# EAGLE design mcu_rev2 (EAGLE 9.5.0)

## Sheet 1 of 2
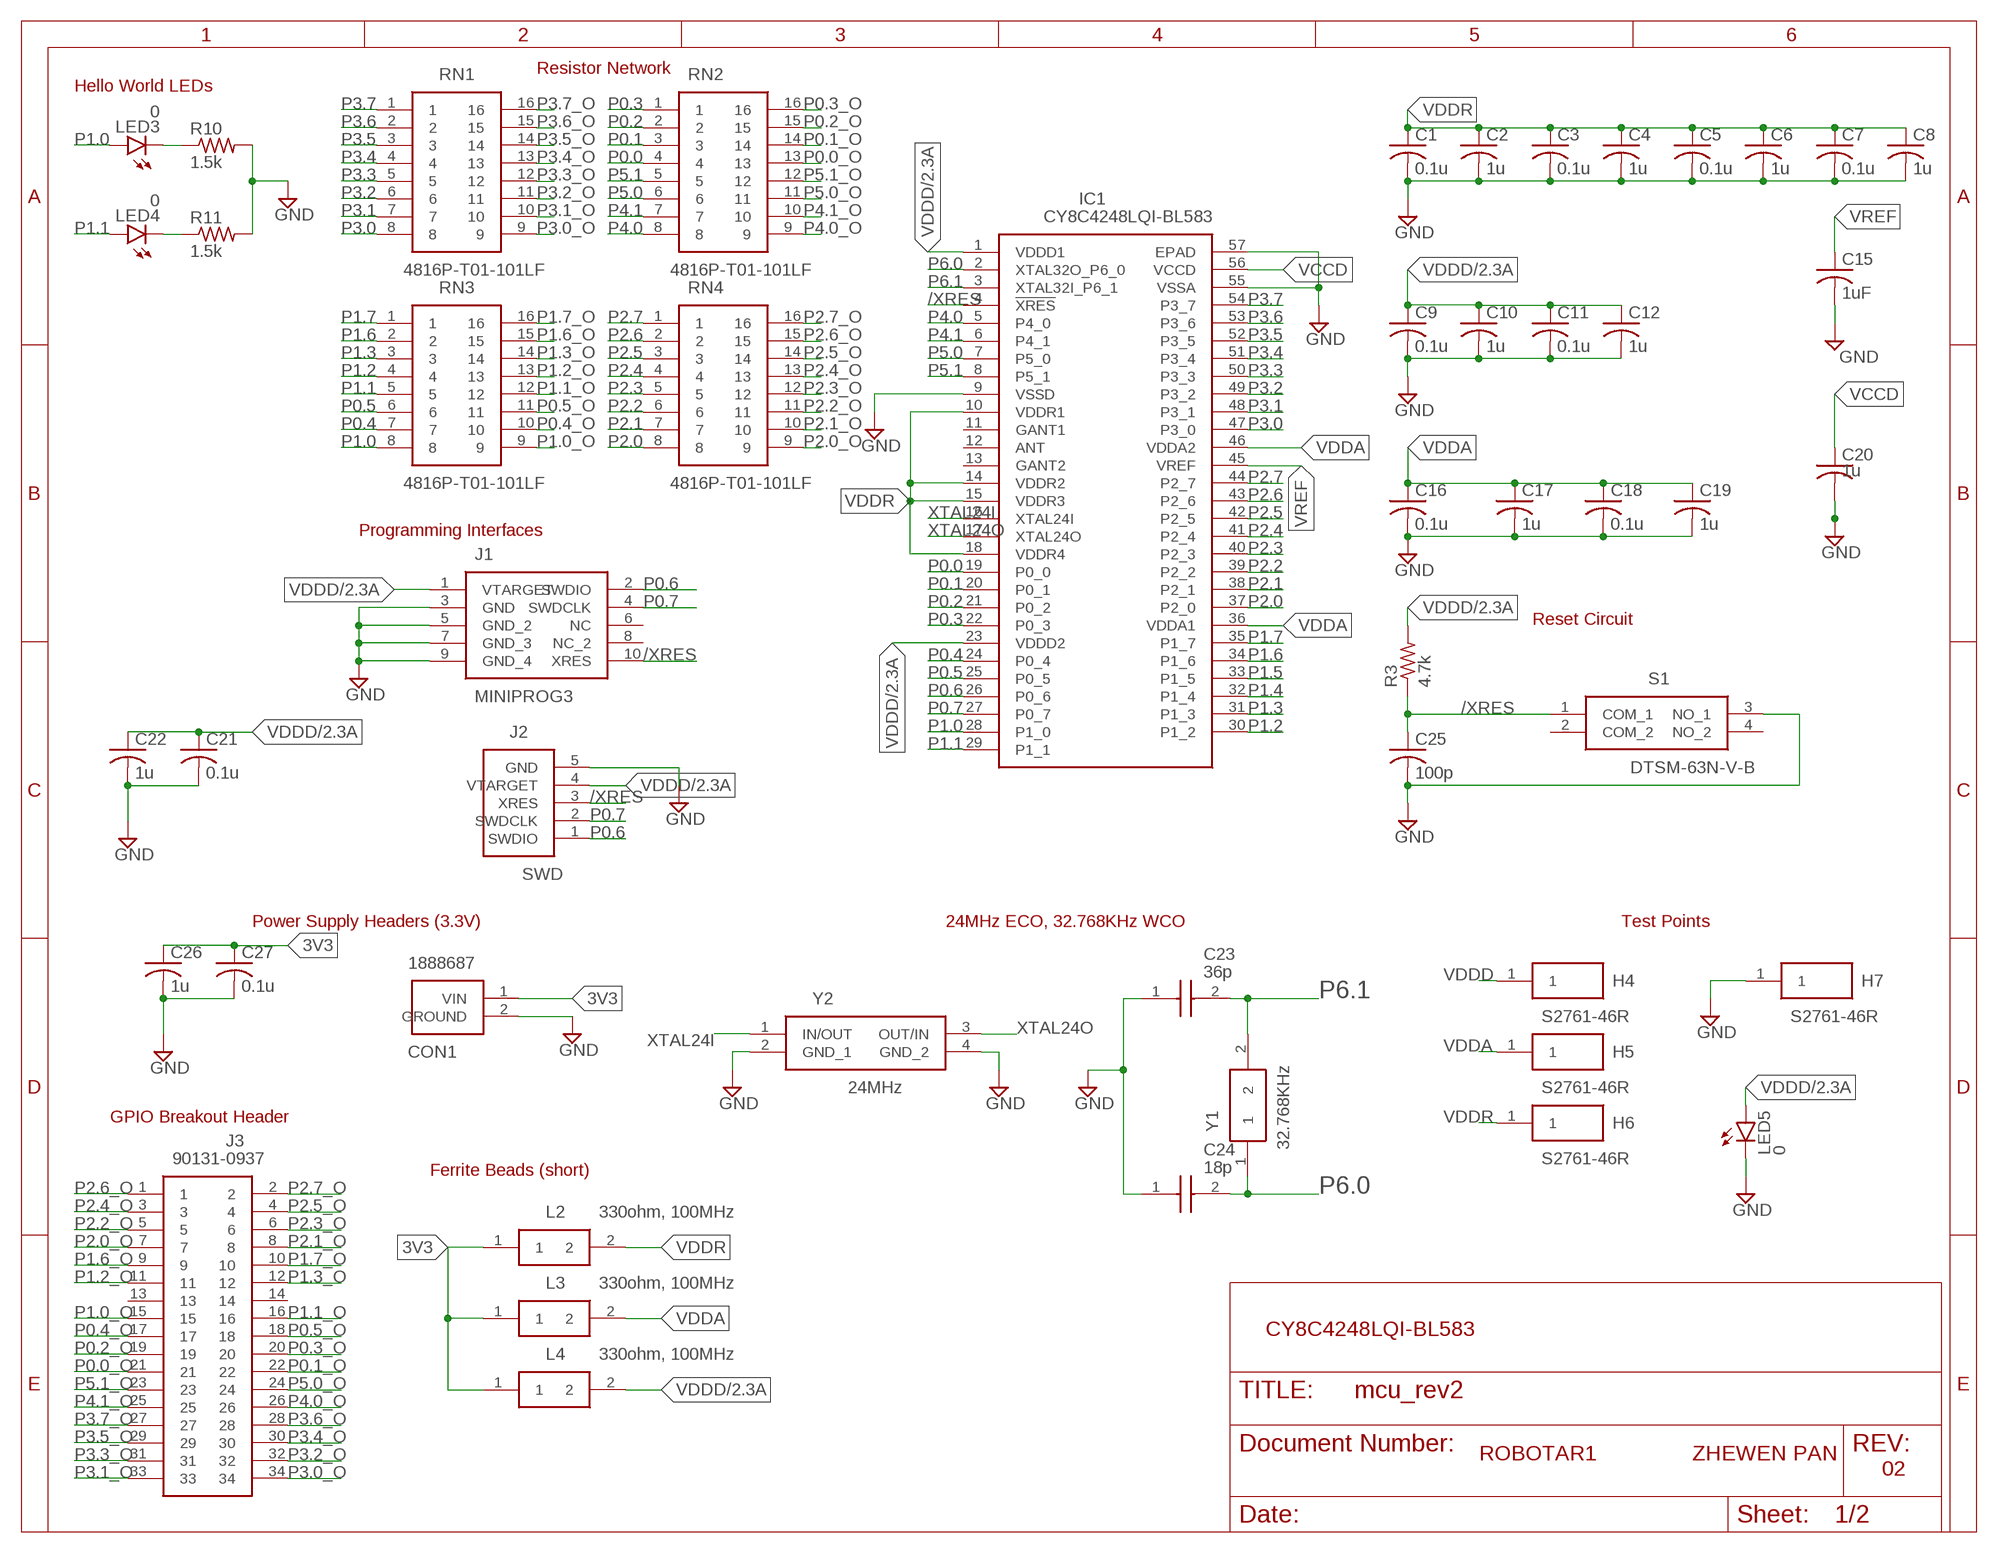
[diagram p0: schematic, sheet 1]

### Parts
C1  0.1u  C-USC0805  [C0805]
C2  1u  C-USC0805  [C0805]
C3  0.1u  C-USC0805  [C0805]
C4  1u  C-USC0805  [C0805]
C5  0.1u  C-USC0805  [C0805]
C6  1u  C-USC0805  [C0805]
C7  0.1u  C-USC0805  [C0805]
C8  1u  C-USC0805  [C0805]
C9  0.1u  C-USC0805  [C0805]
C10  1u  C-USC0805  [C0805]
C11  0.1u  C-USC0805  [C0805]
C12  1u  C-USC0805  [C0805]
C15  1uF  C-USC0805  [C0805]
C16  0.1u  C-USC0805  [C0805]
C17  1u  C-USC0805  [C0805]
C18  0.1u  C-USC0805  [C0805]
C19  1u  C-USC0805  [C0805]
C20  1u  C-USC0805  [C0805]
C21  0.1u  C-USC0805  [C0805]
C22  1u  C-USC0805  [C0805]
C23  36p  GRM1555C1H360JA01D  [CAPC1005X55N]
C24  18p  GRM1555C1H180FA01D  [CAPC1005X55N]
C25  100p  C-USC0805  [C0805]
C26  1u  C-USC0805  [C0805]
C27  0.1u  C-USC0805  [C0805]
CON1  1888687  [SHDR2W90P0X508_1X2_1016X950X15]
H4  S2761-46R  [S276146R]
H5  S2761-46R  [S276146R]
H6  S2761-46R  [S276146R]
H7  S2761-46R  [S276146R]
IC1  CY8C4248LQI-BL583  [QFN40P700X700X60-57N]
J1  MINIPROG3  FTSH-105-01-L-DV-K  [FTSH-105-01-L-DV-K]
J2  SWD  22-23-2051  [HDRV5W64P0X254_1X5_1255X635X81]
J3  90131-0937  [HDRV34W90P254_2X17_4308X500X56]
L2  330ohm, 100MHz  BLM21PG331SN1D  [BEADC2012X105N]
L3  330ohm, 100MHz  BLM21PG331SN1D  [BEADC2012X105N]
L4  330ohm, 100MHz  BLM21PG331SN1D  [BEADC2012X105N]
LED3  0  LEDSML0805  [SML0805]
LED4  0  LEDSML0805  [SML0805]
LED5  0  LEDCHIP-LED0805  [CHIP-LED0805]
R3  4.7k  R-US_R0805  [R0805]
R10  1.5k  R-US_R0805  [R0805]
R11  1.5k  R-US_R0805  [R0805]
RN1  4816P-T01-101LF  [SOIC127P762X215-16N]
RN2  4816P-T01-101LF  [SOIC127P762X215-16N]
RN3  4816P-T01-101LF  [SOIC127P762X215-16N]
RN4  4816P-T01-101LF  [SOIC127P762X215-16N]
S1  DTSM-63N-V-B  [DTSM63NVB]
Y1  32.768KHz  ECS-.327-12.5-34B-TR  [ECX-31B]
Y2  24MHz  ECS-240-8-36CKM-TR  [ECS240836QAESTR]

### Nets
3V3: C26.1 C27.1 CON1.1(VIN) L2.1 L3.1 L4.1
/XRES: C25.1 IC1.4(!XRES) J1.10(XRES) J2.3(XRES) R3.1 S1.1(COM_1)
GND: C1.2 C2.2 C3.2 C4.2 C5.2 C6.2 C7.2 C8.2 C9.2 C10.2 C11.2 C12.2 C15.2 C16.2 C17.2 C18.2 C19.2 C20.2 C21.2 C22.2 C23.1 C24.1 C25.2 C26.2 C27.2 CON1.2(GROUND) H7.1 IC1.9(VSSD) IC1.55(VSSA) IC1.57(EPAD) J1.3(GND) J1.5(GND_2) J1.7(GND_3) J1.9(GND_4) J2.5(GND) LED5.C R10.2 R11.2 S1.3(NO_1) Y2.2(GND_1) Y2.4(GND_2) ; also sheet 2
N$1: LED3.C R10.1
N$2: LED4.C R11.1
P0.0: IC1.19(P0_0) RN2.4
P0.0_O: J3.21 RN2.13
P0.1: IC1.20(P0_1) RN2.3
P0.1_O: J3.22 RN2.14
P0.2: IC1.21(P0_2) RN2.2
P0.2_O: J3.19 RN2.15
P0.3: IC1.22(P0_3) RN2.1
P0.3_O: J3.20 RN2.16
P0.4: IC1.24(P0_4) RN3.7
P0.4_O: J3.17 RN3.10
P0.5: IC1.25(P0_5) RN3.6
P0.5_O: J3.18 RN3.11
P0.6: IC1.26(P0_6) J1.2(SWDIO) J2.1(SWDIO)
P0.7: IC1.27(P0_7) J1.4(SWDCLK) J2.2(SWDCLK)
P1.0: IC1.28(P1_0) LED3.A RN3.8
P1.0_O: J3.15 RN3.9
P1.1: IC1.29(P1_1) LED4.A RN3.5
P1.1_O: J3.16 RN3.12
P1.2: IC1.30(P1_2) RN3.4
P1.2_O: J3.11 RN3.13
P1.3: IC1.31(P1_3) RN3.3
P1.3_O: J3.12 RN3.14
P1.4: IC1.32(P1_4) ; also sheet 2
P1.5: IC1.33(P1_5) ; also sheet 2
P1.6: IC1.34(P1_6) RN3.2 ; also sheet 2
P1.6_O: J3.9 RN3.15
P1.7: IC1.35(P1_7) RN3.1
P1.7_O: J3.10 RN3.16
P2.0: IC1.37(P2_0) RN4.8
P2.0_O: J3.7 RN4.9
P2.1: IC1.38(P2_1) RN4.7
P2.1_O: J3.8 RN4.10
P2.2: IC1.39(P2_2) RN4.6
P2.2_O: J3.5 RN4.11
P2.3: IC1.40(P2_3) RN4.5
P2.3_O: J3.6 RN4.12
P2.4: IC1.41(P2_4) RN4.4
P2.4_O: J3.3 RN4.13
P2.5: IC1.42(P2_5) RN4.3
P2.5_O: J3.4 RN4.14
P2.6: IC1.43(P2_6) RN4.2
P2.6_O: J3.1 RN4.15
P2.7: IC1.44(P2_7) RN4.1
P2.7_O: J3.2 RN4.16
P3.0: IC1.47(P3_0) RN1.8
P3.0_O: J3.34 RN1.9
P3.1: IC1.48(P3_1) RN1.7
P3.1_O: J3.33 RN1.10
P3.2: IC1.49(P3_2) RN1.6
P3.2_O: J3.32 RN1.11
P3.3: IC1.50(P3_3) RN1.5
P3.3_O: J3.31 RN1.12
P3.4: IC1.51(P3_4) RN1.4
P3.4_O: J3.30 RN1.13
P3.5: IC1.52(P3_5) RN1.3
P3.5_O: J3.29 RN1.14
P3.6: IC1.53(P3_6) RN1.2
P3.6_O: J3.28 RN1.15
P3.7: IC1.54(P3_7) RN1.1
P3.7_O: J3.27 RN1.16
P4.0: IC1.5(P4_0) RN2.8
P4.0_O: J3.26 RN2.9
P4.1: IC1.6(P4_1) RN2.7
P4.1_O: J3.25 RN2.10
P5.0: IC1.7(P5_0) RN2.6
P5.0_O: J3.24 RN2.11
P5.1: IC1.8(P5_1) RN2.5
P5.1_O: J3.23 RN2.12
P6.0: C24.2 IC1.2(XTAL32O_P6_0) Y1.1
P6.1: C23.2 IC1.3(XTAL32I_P6_1) Y1.2
VCCD: C20.1 IC1.56(VCCD)
VDDA: C16.1 C17.1 C18.1 C19.1 H5.1 IC1.36(VDDA1) IC1.46(VDDA2) L3.2
VDDD: C9.1 C10.1 C11.1 C12.1 C21.1 C22.1 H4.1 IC1.1(VDDD1) IC1.23(VDDD2) J1.1(VTARGET) J2.4(VTARGET) L4.2 LED5.A R3.2 ; also sheet 2
VDDR: C1.1 C2.1 C3.1 C4.1 C5.1 C6.1 C7.1 C8.1 H6.1 IC1.10(VDDR1) IC1.14(VDDR2) IC1.15(VDDR3) IC1.18(VDDR4) L2.2
VREF: C15.1 IC1.45(VREF)
XTAL24I: IC1.16(XTAL24I) Y2.1(IN/OUT)
XTAL24O: IC1.17(XTAL24O) Y2.3(OUT/IN)
Unconnected: IC1.11(GANT1) IC1.12(ANT) IC1.13(GANT2) J1.6(NC) J1.8(NC_2) J3.13 J3.14 S1.2(COM_2) S1.4(NO_2)

### Notes on the sheet
- Resistor Network
- Hello World LEDs
- Programming Interfaces
- Reset Circuit
- Power Supply Headers (3.3V) | 24MHz ECO, 32.768KHz WCO | Test Points
- GPIO Breakout Header
- Ferrite Beads (short)
- CY8C4248LQI-BL583
- ROBOTAR1 | ZHEWEN PAN | 02

## Sheet 2 of 2
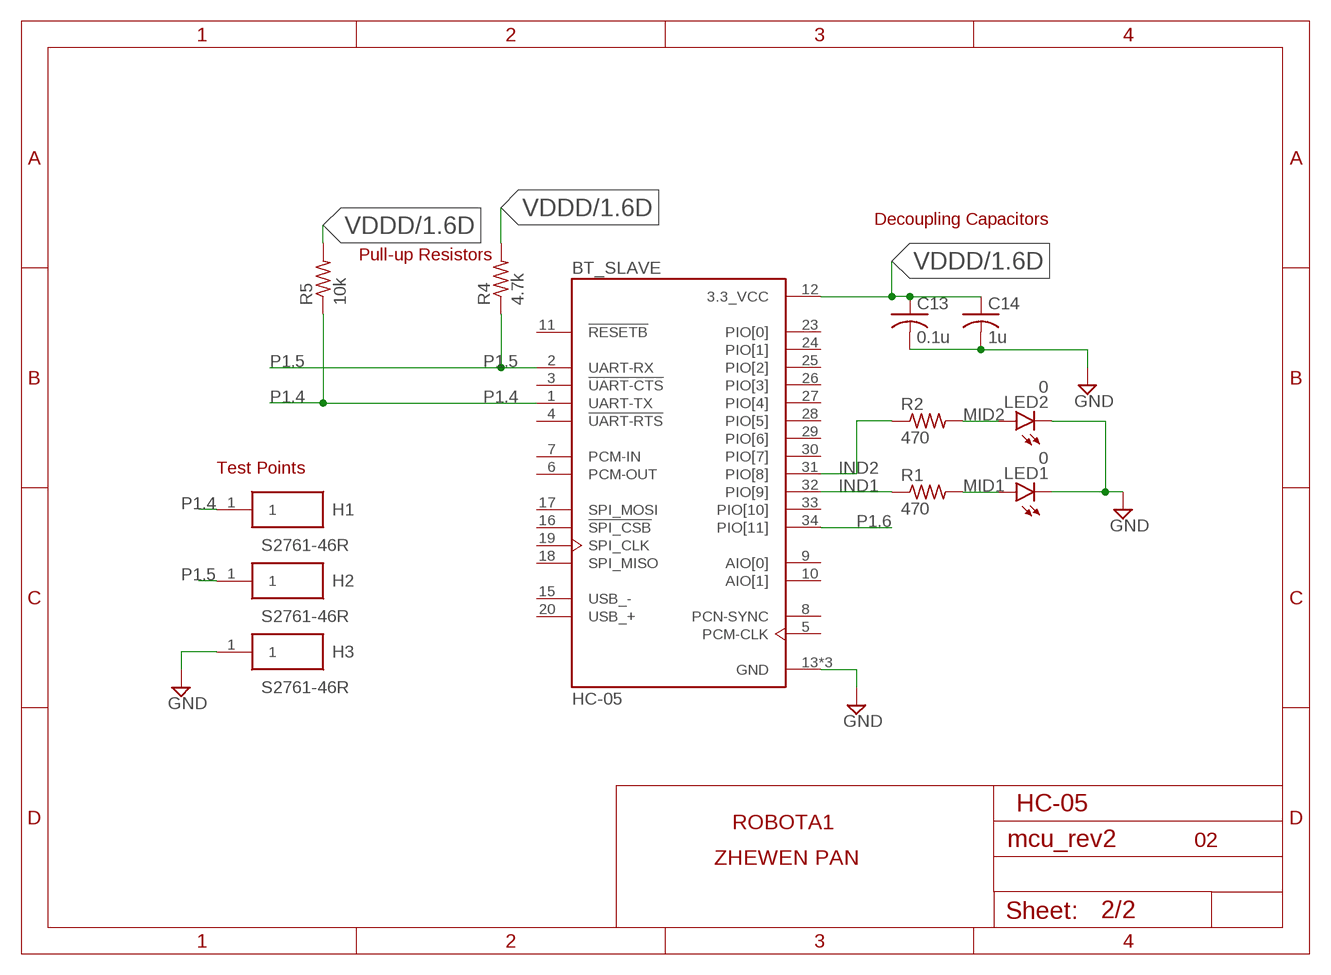
[diagram p1: schematic, sheet 2]

### Parts
BT_SLAVE  HC-05  [XCVR_HC-05]
C13  0.1u  C-USC0805  [C0805]
C14  1u  C-USC0805  [C0805]
H1  S2761-46R  [S276146R]
H2  S2761-46R  [S276146R]
H3  S2761-46R  [S276146R]
LED1  0  LEDSML0805  [SML0805]
LED2  0  LEDSML0805  [SML0805]
R1  470  R-US_R0805  [R0805]
R2  470  R-US_R0805  [R0805]
R4  4.7k  R-US_R0805  [R0805]
R5  10k  R-US_R0805  [R0805]

### Nets
GND: BT_SLAVE.13(GND) BT_SLAVE.21(GND) BT_SLAVE.22(GND) C13.2 C14.2 H3.1 LED1.C LED2.C ; also sheet 1
IND1: BT_SLAVE.32(PIO[9]) R1.1
IND2: BT_SLAVE.31(PIO[8]) R2.1
MID1: LED1.A R1.2
MID2: LED2.A R2.2
P1.4: BT_SLAVE.1(UART-TX) H1.1 R5.1 ; also sheet 1
P1.5: BT_SLAVE.2(UART-RX) H2.1 R4.1 ; also sheet 1
P1.6: BT_SLAVE.34(PIO[11]) ; also sheet 1
VDDD: BT_SLAVE.12(3.3_VCC) C13.1 C14.1 R4.2 R5.2 ; also sheet 1
Unconnected: BT_SLAVE.3(!UART-CTS) BT_SLAVE.4(!UART-RTS) BT_SLAVE.5(PCM-CLK) BT_SLAVE.6(PCM-OUT) BT_SLAVE.7(PCM-IN) BT_SLAVE.8(PCN-SYNC) BT_SLAVE.9(AIO[0]) BT_SLAVE.10(AIO[1]) BT_SLAVE.11(!RESETB) BT_SLAVE.15(USB_-) BT_SLAVE.16(!SPI_CSB) BT_SLAVE.17(SPI_MOSI) BT_SLAVE.18(SPI_MISO) BT_SLAVE.19(SPI_CLK) BT_SLAVE.20(USB_+) BT_SLAVE.23(PIO[0]) BT_SLAVE.24(PIO[1]) BT_SLAVE.25(PIO[2]) BT_SLAVE.26(PIO[3]) BT_SLAVE.27(PIO[4]) BT_SLAVE.28(PIO[5]) BT_SLAVE.29(PIO[6]) BT_SLAVE.30(PIO[7]) BT_SLAVE.33(PIO[10])

### Notes on the sheet
- Decoupling Capacitors
- Pull-up Resistors
- Test Points
- HC-05
- ROBOTA1
- 02
- ZHEWEN PAN

## Library data of the parts
BT_SLAVE = HC-05:HC-05: Bluetooth to Serial Port Module; AVAILABILITY: Unavailable; MF: Texas Instruments; MP: HC-05; PACKAGE: SOIC-14; PRICE: None; SPICEPREFIX: X
C1-C22 C25-C27 = rcl:C-US: CAPACITOR, American symbol; SPICEPREFIX: C
C23 = GRM1555C1H360JA01D:GRM1555C1H360JA01D: Murata 0402 GRM 36pF Ceramic Multilayer Capacitor, 50 V dc, +125C, C0G Dielectric, +/-5% SMD Source: Datasheet <http://uk.rs-online.com/web/p/products/8145643P>; DESCRIPTION: Murata 0402 GRM 36pF Ceramic Multilayer Capacitor, 50 V dc, +125C, C0G Dielectric, +/-5% SMD; HEIGHT: 0.55mm; MANUFACTURER_NAME: Murata Electronics; MANUFACTURER_PART_NUMBER: GRM1555C1H360JA01D; RS_PART_NUMBER: 8145643P; RS_PRICE-STOCK: http://uk.rs-online.com/web/p/products/8145643P
C24 = GRM1555C1H180FA01D:GRM1555C1H180FA01D: Murata 0402 GRM 18pF Ceramic Multilayer Capacitor, 50 V dc, +125C, C0G Dielectric SMD Source: Datasheet <http://uk.rs-online.com/web/p/products/7235373P>; DESCRIPTION: Murata 0402 GRM 18pF Ceramic Multilayer Capacitor, 50 V dc, +125C, C0G Dielectric SMD; HEIGHT: 0.55mm; MANUFACTURER_NAME: Murata Electronics; MANUFACTURER_PART_NUMBER: GRM1555C1H180FA01D; RS_PART_NUMBER: 7235373P; RS_PRICE-STOCK: http://uk.rs-online.com/web/p/products/7235373P
CON1 = SamacSys_Parts:1888687: Phoenix Contact COMBICON MKDSN Series 5.08mm Pitch Straight PCB Terminal Block with Screw Termination, Through Hole Source: Datasheet <http://uk.rs-online.com/web/p/products/8045095>; ALLIED_NUMBER: 70054422; DESCRIPTION: Phoenix Contact COMBICON MKDSN Series 5.08mm Pitch Straight PCB Terminal Block with Screw Termination, Through Hole; HEIGHT: 15mm; MANUFACTURER_NAME: Phoenix Contact; MANUFACTURER_PART_NUMBER: 1888687; RS_PART_NUMBER: 8045095; RS_PRICE-STOCK: http://uk.rs-online.com/web/p/products/8045095
H1-H7 = S2761-46R:S2761-46R: Circuit Board Hardware - PCB SMT Mini Test Terminal, Reel Source: Datasheet <https://cdn.harwin.com/pdfs/S2761R.pdf>; DESCRIPTION: Circuit Board Hardware - PCB SMT Mini Test Terminal, Reel; HEIGHT: 1.15mm; MANUFACTURER_NAME: HARWIN; MANUFACTURER_PART_NUMBER: S2761-46R
IC1 = CY8C4248LQI-BL583:CY8C4248LQI-BL583: PSoC 4xx8_BLE Source: Datasheet <http://uk.rs-online.com/web/p/products/1771220P>; DESCRIPTION: PSoC 4xx8_BLE; HEIGHT: mm; MANUFACTURER_NAME: Cypress Semiconductor; MANUFACTURER_PART_NUMBER: CY8C4248LQI-BL583; RS_PART_NUMBER: 1771220P; RS_PRICE-STOCK: http://uk.rs-online.com/web/p/products/1771220P
J1 = SamacSys_Parts:FTSH-105-01-L-DV-K: SMT Micro Header, 10 position, 2-row Source: Datasheet <http://suddendocs.samtec.com/catalog_english/ftsh_smt.pdf>; DESCRIPTION: SMT Micro Header, 10 position, 2-row; HEIGHT: mm; MANUFACTURER_NAME: SAMTEC; MANUFACTURER_PART_NUMBER: FTSH-105-01-L-DV-K; RS_PART_NUMBER: 1592332; RS_PRICE-STOCK: https://uk.rs-online.com/web/p/products/1592332
J2 = SamacSys_Parts:22-23-2051: Headers & Wire Housings VERT PCB HDR 5P TIN FRICTION LOCK Source: Datasheet <http://uk.rs-online.com/web/p/products/1888757>; ALLIED_NUMBER: 70190811; DESCRIPTION: Headers & Wire Housings VERT PCB HDR 5P TIN FRICTION LOCK; HEIGHT: 8.18mm; MANUFACTURER_NAME: Molex; MANUFACTURER_PART_NUMBER: 22-23-2051; RS_PART_NUMBER: 1888757; RS_PRICE-STOCK: http://uk.rs-online.com/web/p/products/1888757
J3 = 90131-0937:90131-0937: Molex C-GRID III Series, Series Number 90131, 2.54mm Pitch 34 Way 2 Row Straight PCB Header, Solder Termination, 3A Source: Datasheet <http://uk.rs-online.com/web/p/products/6703569>; ALLIED_NUMBER: 70373750; DESCRIPTION: Molex C-GRID III Series, Series Number 90131, 2.54mm Pitch 34 Way 2 Row Straight PCB Header, Solder Termination, 3A; HEIGHT: 5.6mm; MANUFACTURER_NAME: Molex; MANUFACTURER_PART_NUMBER: 90131-0937; RS_PART_NUMBER: 6703569; RS_PRICE-STOCK: http://uk.rs-online.com/web/p/products/6703569
L2-L4 = BLM21PG331SN1D:BLM21PG331SN1D: Ferrite bead 0805 SMD 330R 1.5A Ferrite bead 0805 SMD 330R 1.5A Source: Datasheet <http://uk.rs-online.com/web/p/products/7241545P>; DESCRIPTION: Ferrite bead 0805 SMD 330R 1.5A Ferrite bead 0805 SMD 330R 1.5A; HEIGHT: 1.05mm; MANUFACTURER_NAME: Murata Electronics; MANUFACTURER_PART_NUMBER: BLM21PG331SN1D; RS_PART_NUMBER: 7241545P; RS_PRICE-STOCK: http://uk.rs-online.com/web/p/products/7241545P
LED1-LED5 = led:LED: LED OSRAM: - CHIPLED LG R971, LG N971, LY N971, LG Q971, LY Q971, LO R971, LY R971 LH N974, LH R974 LS Q976, LO Q976, LY Q976 LO Q996 - Hyper CHIPLED LW Q18S LB Q993, LB Q99A, LB R99A - SideLED LS A670, LO A670, LY A670, LG A670, LP A670 LB A673, LV A673, LT A673, LW A673 LH A674 LY A675 LS A676, LA A676, LO A676, LY A676, LW A676 LS A679, LY A679, LG A679 - Hyper Micro SIDELED® LS Y876, LA Y876, LO Y876, LY Y876 LT Y87S - SmartLED LW L88C, LW L88S LB L89C, LB L89S, LG L890 LS L89K, LO L89K, LY L89K LS L896, LA L896, LO L896, LY L896 - TOPLED LS T670, LO T670, LY T670, LG T670, LP T670 LSG T670, LSP T670, LSY T670, LOP T670, LYG T670 LG T671, LOG T671, LSG T671 LB T673, LV T673, LT T673, LW T673 LH T674 LS T676, LA T676, LO T676, LY T676, LB T676, LH T676, LSB T676, LW T676 LB T67C, LV T67C, LT T67C, LS T67K, LO T67K, LY T67K, LW E67C LS E67B, LA E67B, LO E67B, LY E67B, LB E67C, LV E67C, LT E67C LW T67C LS T679, LY T679, LG T679 LS T770, LO T770, LY T770, LG T770, LP T770 LB T773, LV T773, LT T773, LW T773 LH T774 LS E675, LA E675, LY E675, LS T675 LS T776, LA T776, LO T776, LY T776, LB T776 LHGB T686 LT T68C, LB T68C - Hyper Mini TOPLED® LB M676 - Mini TOPLED Santana® LG M470 LS M47K, LO M47K, LY M47K Source: http://www.osram.convergy.de LUXEON: - LUMILED® LXK2-PW12-R00, LXK2-PW12-S00, LXK2-PW14-U00, LXK2-PW14-V00 LXK2-PM12-R00, LXK2-PM12-S00, LXK2-PM14-U00 LXK2-PE12-Q00, LXK2-PE12-R00, LXK2-PE12-S00, LXK2-PE14-T00, LXK2-PE14-U00 LXK2-PB12-K00, LXK2-PB12-L00, LXK2-PB12-M00, LXK2-PB14-N00, LXK2-PB14-P00, LXK2-PB14-Q00 LXK2-PR12-L00, LXK2-PR12-M00, LXK2-PR14-Q00, LXK2-PR14-R00 LXK2-PD12-Q00, LXK2-PD12-R00, LXK2-PD12-S00 LXK2-PH12-R00, LXK2-PH12-S00 LXK2-PL12-P00, LXK2-PL12-Q00, LXK2-PL12-R00 Source: www.luxeon.com KINGBRIGHT: KA-3528ASYC Source: www.kingbright.com
R1-R5 R10 R11 = rcl:R-US_: RESISTOR, American symbol; SPICEPREFIX: R
RN1-RN4 = 4816P-T01-101LF:4816P-T01-101LF: 8-isolated SMT resistor network,100R Bourns Isolated Resistor Array 100 +/-2% 8 Resistors, 1.28W Total, SOM package 4800P Source: Datasheet <http://uk.rs-online.com/web/p/products/5224942P>; ALLIED_NUMBER: 70155540; DESCRIPTION: 8-isolated SMT resistor network,100R Bourns Isolated Resistor Array 100 +/-2% 8 Resistors, 1.28W Total, SOM package 4800P; HEIGHT: 2.15mm; MANUFACTURER_NAME: Bourns; MANUFACTURER_PART_NUMBER: 4816P-T01-101LF; RS_PART_NUMBER: 5224942P; RS_PRICE-STOCK: http://uk.rs-online.com/web/p/products/5224942P
S1 = push_button:DTSM-63N-V-B: Tactile Switches Surface Mounting Type 6*6 Source: Datasheet <http://www.dip.com.tw/en/en-product-information/en-switch004/item/download/2502_92b64433b455dc19d9198989b26071be>; DESCRIPTION: Tactile Switches Surface Mounting Type 6*6; HEIGHT: 7.1mm; MANUFACTURER_NAME: Diptronics; MANUFACTURER_PART_NUMBER: DTSM-63N-V-B
Y1 = SamacSys_Parts:ECS-.327-12.5-34B-TR: Crystals 32.768KHz 20ppm 12.5pF -40C +85C Source: Datasheet; DESCRIPTION: Crystals 32.768KHz 20ppm 12.5pF -40C +85C; HEIGHT: mm; MANUFACTURER_NAME: ECS; MANUFACTURER_PART_NUMBER: ECS-.327-12.5-34B-TR
Y2 = SamacSys_Parts:ECS-240-8-36CKM-TR: Crystals 24MHz 10ppm Source: Datasheet; DESCRIPTION: Crystals 24MHz 10ppm; HEIGHT: 0mm; MANUFACTURER_NAME: ECS; MANUFACTURER_PART_NUMBER: ECS-240-8-36CKM-TR; SPICEPREFIX: E

## Board
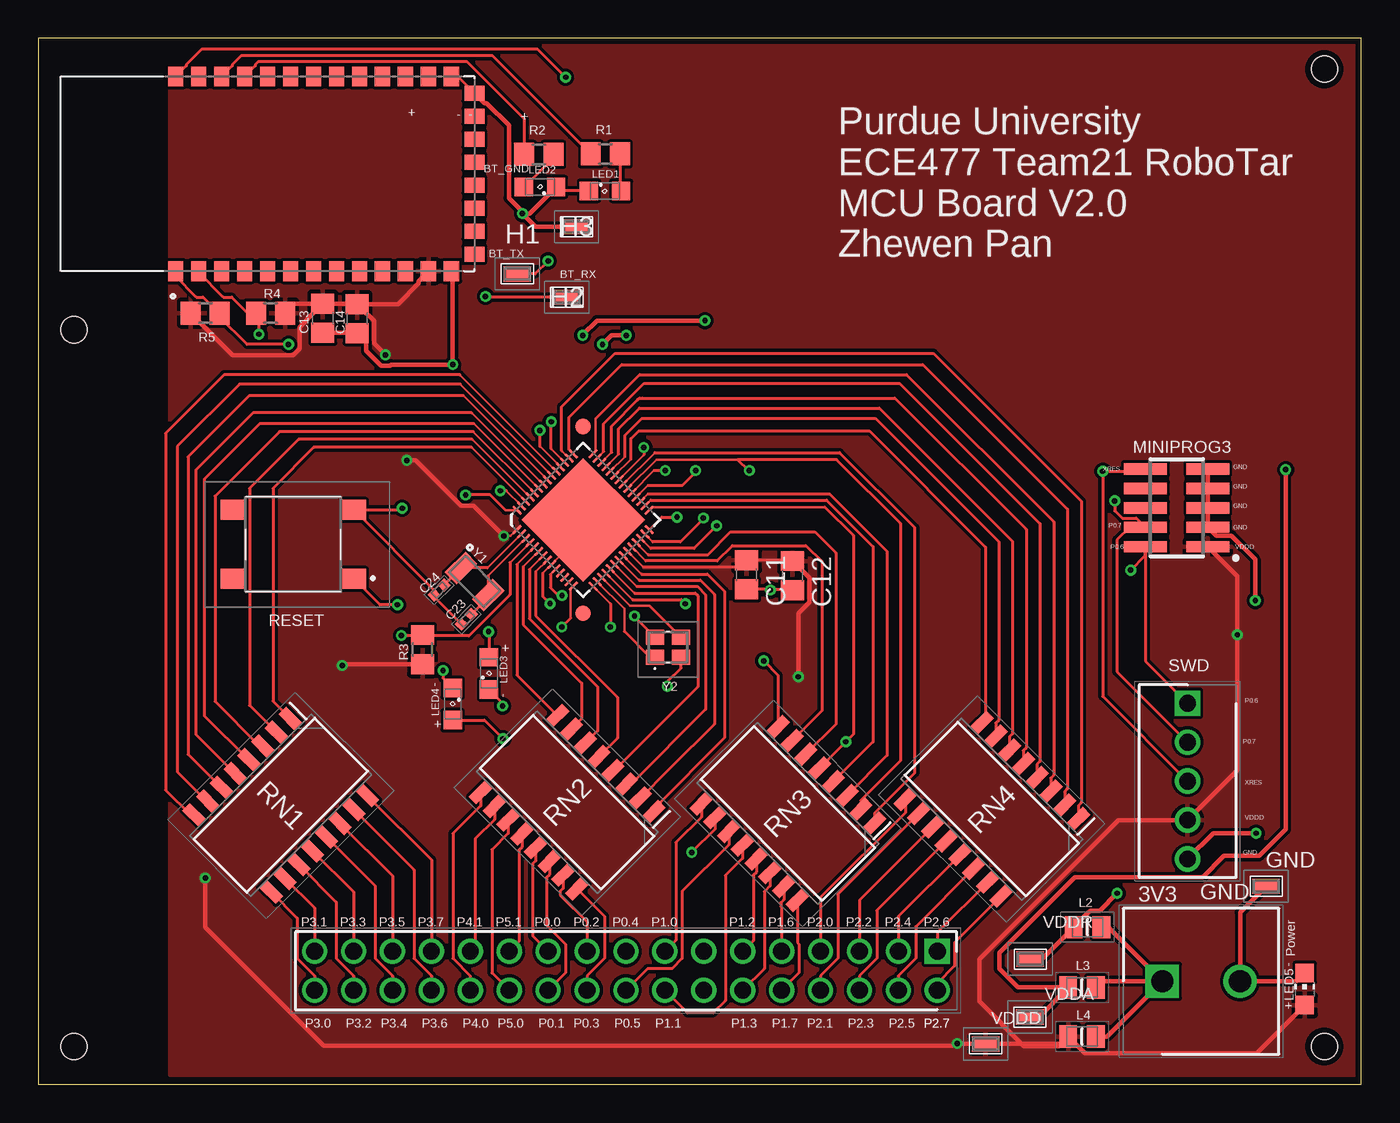
[diagram p2: board, top side]
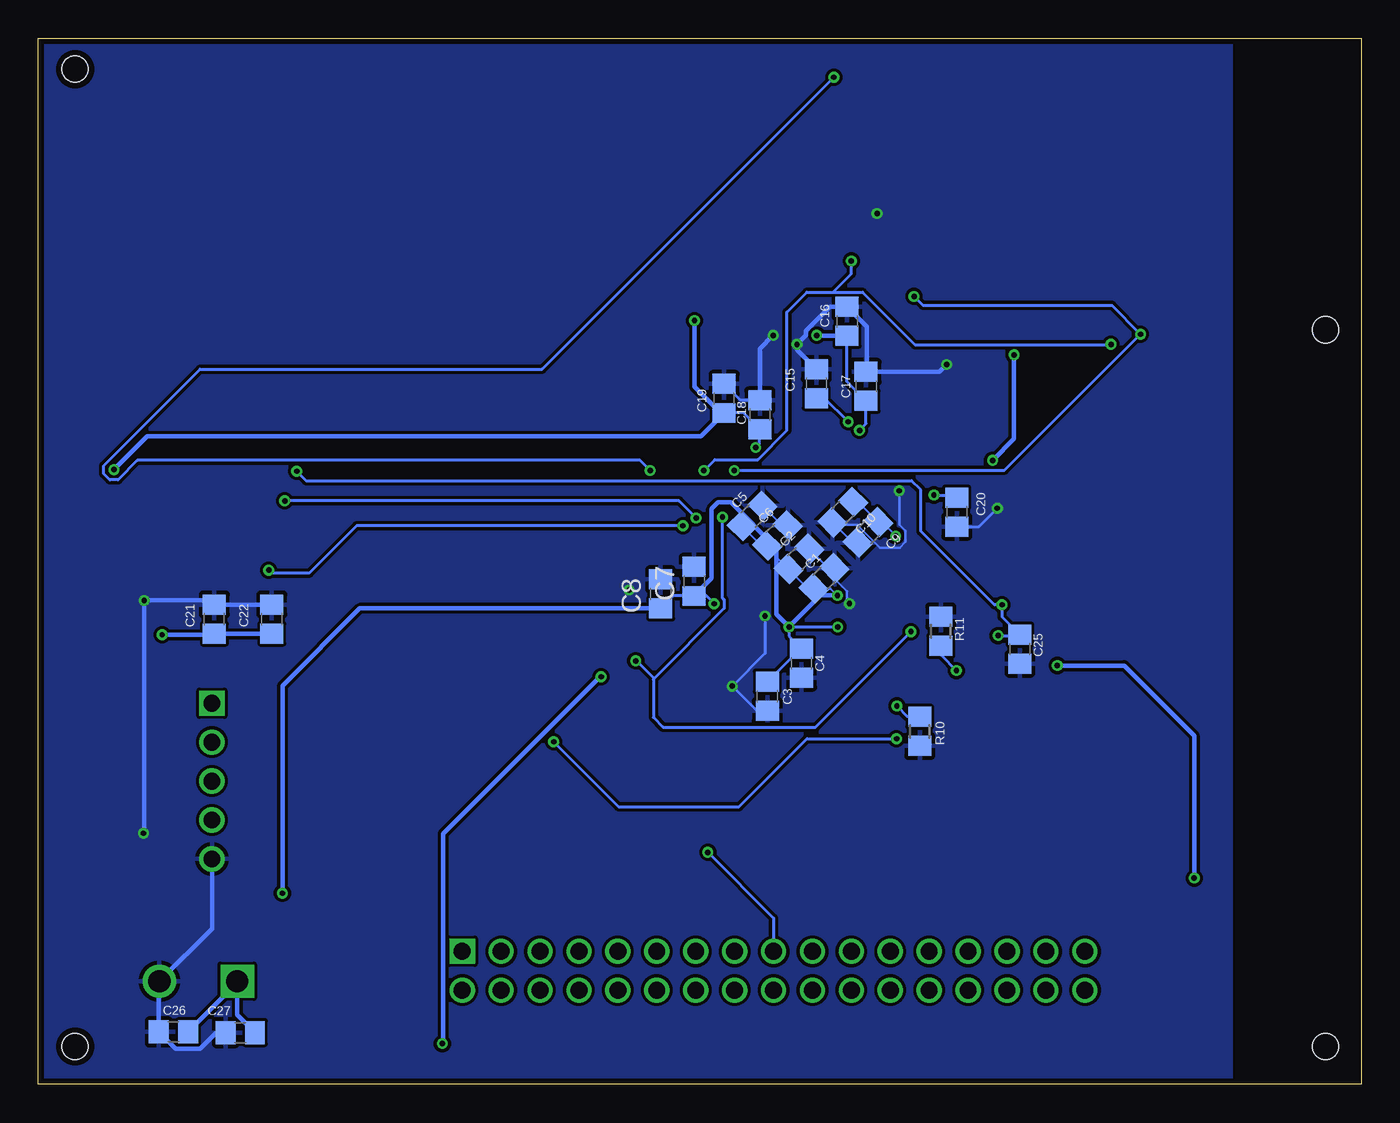
[diagram p3: board, bottom side, seen from below]

Size 86.34 x 68.25 mm. Coordinates in mm from the lower left corner, seen from the top.
Outline: 0,0 86.34,0 86.34,68.25 0,68.25 0,0
Copper layers (1*16): Top 0.0356mm / dielectric 1.5011mm / Bottom 0.0356mm
Design rules "ECE_Senior_Design_default *": minimum track width 6mil, minimum drill 13mil, track to track 8mil, track to pad 8mil, pad to pad 6mil, via to via 8mil, smd to smd 6mil, copper to edge 15mil, drill to drill 8mil, minimum pad ring 7mil, minimum via ring 7mil, stop-mask expansion 3mil, vias tented up to drill 0mil, thermal gap 10mil
Holes 1.7 mm at 2.34,2.47 83.94,2.47 83.94,66.23 2.34,49.23

### Footprints (pad centres in the part's own frame; a part is rotated, then mirrored left to right if it is on the bottom)
XCVR_HC-05 = smd 1.3 x 1: 1 -6.35,6.325; 2 -6.35,4.825; 3 -6.35,3.325; 4 -6.35,1.825; 5 -6.35,0.325; 6 -6.35,-1.175; 7 -6.35,-2.675; 8 -6.35,-4.175; 9 -6.35,-5.675; 10 -6.35,-7.175; 11 -6.35,-8.675; 12 -6.35,-10.175; 13 -6.35,-11.675; 22 6.35,-11.675; 23 6.35,-10.175; 24 6.35,-8.675; 25 6.35,-7.175; 26 6.35,-5.675; 27 6.35,-4.175; 28 6.35,-2.675; 29 6.35,-1.175; 30 6.35,0.325; 31 6.35,1.825; 32 6.35,3.325; 33 6.35,4.825; 34 6.35,6.325 | smd 1 x 1.3: 14 -5.25,-13.175; 15 -3.75,-13.175; 16 -2.25,-13.175; 17 -0.75,-13.175; 18 0.75,-13.175; 19 2.25,-13.175; 20 3.75,-13.175; 21 5.25,-13.175
C0805 = smd 1.3 x 1.5: 1 -0.95,0; 2 0.95,0
CAPC1005X55N = smd 0.6 x 0.62: 1 -0.46,0; 2 0.46,0
SHDR2W90P0X508_1X2_1016X950X15 = drill 1.45 pad 2.175 square: 1 0,0 | drill 1.45 pad 2.175: 2 5.08,0
S276146R = smd 1.8 x 1: 1 0,0
QFN40P700X700X60-57N = smd 0.8 x 0.2: 1 -3.5,2.6; 2 -3.5,2.2; 3 -3.5,1.8; 4 -3.5,1.4; 5 -3.5,1; 6 -3.5,0.6; 7 -3.5,0.2; 8 -3.5,-0.2; 9 -3.5,-0.6; 10 -3.5,-1; 11 -3.5,-1.4; 12 -3.5,-1.8; 13 -3.5,-2.2; 14 -3.5,-2.6; 29 3.5,-2.6; 30 3.5,-2.2; 31 3.5,-1.8; 32 3.5,-1.4; 33 3.5,-1; 34 3.5,-0.6; 35 3.5,-0.2; 36 3.5,0.2; 37 3.5,0.6; 38 3.5,1; 39 3.5,1.4; 40 3.5,1.8; 41 3.5,2.2; 42 3.5,2.6 | smd 0.2 x 0.8: 15 -2.6,-3.5; 16 -2.2,-3.5; 17 -1.8,-3.5; 18 -1.4,-3.5; 19 -1,-3.5; 20 -0.6,-3.5; 21 -0.2,-3.5; 22 0.2,-3.5; 23 0.6,-3.5; 24 1,-3.5; 25 1.4,-3.5; 26 1.8,-3.5; 27 2.2,-3.5; 28 2.6,-3.5; 43 2.6,3.5; 44 2.2,3.5; 45 1.8,3.5; 46 1.4,3.5; 47 1,3.5; 48 0.6,3.5; 49 0.2,3.5; 50 -0.2,3.5; 51 -0.6,3.5; 52 -1,3.5; 53 -1.4,3.5; 54 -1.8,3.5; 55 -2.2,3.5; 56 -2.6,3.5 | smd 5.7 x 5.7: 57 0,0 | smd 1 x 1: 58 4.309,4.309; 59 -4.309,-4.309
FTSH-105-01-L-DV-K = smd 0.74 x 2.79: 1 -2.54,-2.035; 2 -2.54,2.035; 3 -1.27,-2.035; 4 -1.27,2.035; 5 0,-2.035; 6 0,2.035; 7 1.27,-2.035; 8 1.27,2.035; 9 2.54,-2.035; 10 2.54,2.035
HDRV5W64P0X254_1X5_1255X635X81 = drill 1.1 pad 1.65 square: 1 0,0 | drill 1.1 pad 1.65: 2 2.54,0; 3 5.08,0; 4 7.62,0; 5 10.16,0
HDRV34W90P254_2X17_4308X500X56 = drill 1.1 pad 1.65 square: 1 0,0 | drill 1.1 pad 1.65: 2 0,2.54; 3 2.54,0; 4 2.54,2.54; 5 5.08,0; 6 5.08,2.54; 7 7.62,0; 8 7.62,2.54; 9 10.16,0; 10 10.16,2.54; 11 12.7,0; 12 12.7,2.54; 13 15.24,0; 14 15.24,2.54; 15 17.78,0; 16 17.78,2.54; 17 20.32,0; 18 20.32,2.54; 19 22.86,0; 20 22.86,2.54; 21 25.4,0; 22 25.4,2.54; 23 27.94,0; 24 27.94,2.54; 25 30.48,0; 26 30.48,2.54; 27 33.02,0; 28 33.02,2.54; 29 35.56,0; 30 35.56,2.54; 31 38.1,0; 32 38.1,2.54; 33 40.64,0; 34 40.64,2.54
BEADC2012X105N = smd 1.15 x 1.45: 1 -0.9,0; 2 0.9,0
SML0805 = smd 1.2 x 1.2: A 1.05,0; C -1.05,0
CHIP-LED0805 = smd 1.2 x 1.2: A 0,-1.05; C 0,1.05
R0805 = smd 1.3 x 1.5: 1 -0.95,0; 2 0.95,0
SOIC127P762X215-16N = smd 1.505 x 0.7: 1 -3.548,4.445; 2 -3.548,3.175; 3 -3.548,1.905; 4 -3.548,0.635; 5 -3.548,-0.635; 6 -3.548,-1.905; 7 -3.548,-3.175; 8 -3.548,-4.445; 9 3.548,-4.445; 10 3.548,-3.175; 11 3.548,-1.905; 12 3.548,-0.635; 13 3.548,0.635; 14 3.548,1.905; 15 3.548,3.175; 16 3.548,4.445
DTSM63NVB = smd 1.55 x 1.3: 1 -3.975,2.25; 2 3.975,2.25; 3 -3.975,-2.25; 4 3.975,-2.25
ECX-31B = smd 1.1 x 1.9: 1 -1.25,0; 2 1.25,0
ECS240836QAESTR = smd 1.2 x 1: 1 -0.85,-0.65; 2 0.85,-0.65; 3 0.85,0.65; 4 -0.85,0.65

### Placement (x,y rotation side)
BT_SLAVE  15.29,59.41 90 top
C1  35.05,33.02 45 bottom
C2  36.7,34.29 45 bottom
C3  38.76,25.32 270 bottom
C4  36.53,27.48 270 bottom
C5  39.75,37.08 45 bottom
C6  38.1,35.81 45 bottom
C7  43.54,32.82 90 bottom
C8  45.72,32 90 bottom
C9  32.18,36.02 225 bottom
C10  33.83,37.34 225 bottom
C11  46.23,33.25 270 top
C12  49.23,33.2 270 top
C13  18.57,49.99 270 top
C14  20.8,49.96 270 top
C15  35.56,45.72 90 bottom
C16  33.55,49.78 90 bottom
C17  32.31,45.54 90 bottom
C18  39.24,43.69 90 bottom
C19  41.58,44.75 90 bottom
C20  26.39,37.34 270 bottom
C21  74.85,30.35 90 bottom
C22  71.09,30.35 90 bottom
C23  27.94,30.35 45 top
C24  26.16,32.26 45 top
C25  22.28,28.4 270 bottom
C26  77.52,3.43 180 bottom
C27  73.15,3.38 180 bottom
CON1  73.36,6.73 0 top
H1  31.27,52.88 0 top
H2  34.49,51.36 0 top
H3  35.13,55.96 0 top
H4  61.82,2.64 0 top
H5  64.72,4.39 0 top
H6  64.74,8.18 0 top
H7  80.14,12.93 0 top
IC1  35.56,36.83 45 top
J1  74.29,37.62 90 top
J2  75.01,24.87 270 top
J3  58.67,8.69 180 top
L2  68.48,10.26 180 top
L3  68.12,6.32 180 top
L4  68.12,3.12 180 top
LED1  36.98,58.29 0 top
LED2  32.74,58.55 180 top
LED3  29.41,26.82 90 top
LED4  27.05,24.82 270 top
LED5  82.65,6.22 0 top
R1  37.01,60.71 0 top
R2  32.66,60.68 0 top
R3  25.07,28.37 270 top
R4  15.16,50.32 0 top
R5  10.9,50.32 180 top
R10  28.8,23.04 270 bottom
R11  27.43,29.57 90 bottom
RN1  15.82,18.21 315 top
RN2  34.52,18.41 225 top
RN3  48.92,17.68 225 top
RN4  62.23,17.96 225 top
S1  16.64,35.23 180 top
Y1  28.47,32.82 315 top
Y2  41.1,28.52 0 top

### Tracks (layer width: path | path; a pad name or v marks a point on that pad's centre or on a via)
3V3
  Top 0.305: L3.1 69.43,6.73 CON1.1 | L2.1 69.82,10.26 CON1.1 | CON1.1 69.75,3.12 L4.1
  Bottom 0.305: C26.1 73.35,6.64 CON1.1 73.35,4.53 73.1,4.27 C27.1
/XRES  (via drill 0.35)
  Top 0.152: IC1.4 30.78,34.03
  Top 0.203: 30.78,34.03 30.78,31.95 28.1,29.27 25.12,29.27 R3.1 25.03,29.29 v23.7,29.29 | v23.44,31.29 22.3,31.29 S1.1 | J1.10 72.11,40 v69.47,40 69.47,25.32 J2.3
  Bottom 0.203: v23.7,29.29 22.34,29.29 C25.1 23.44,30.52 v23.44,31.29 23.93,31.29 28.74,36.1 28.74,38.78 29.35,39.39 68.86,39.39 v69.47,40
GND  (via drill 0.35)
  Top 0.152: IC1.55 30.54,38.73 | 32.92,33.35 IC1.9 35.97,36.39
  Top 0.203: C11.2 47.74,32.3 v47.78,32.26 49.21,32.26 C12.2 | v23.75,37.59 23.64,37.48 S1.3 25.84,32.25 C24.1 25.84,31.81 C23.1 | 30.54,38.73 v30.15,38.73 | LED2.C 34.05,58.29 LED1.C | 32.92,33.35 32.92,31.84 v33.4,31.37 | 35.97,36.39 35.97,36.42 | Y2.4 38.91,30.51 v38.91,30.56 | v41.05,25.98 41.05,26.26 41.95,27.16 Y2.2 | BT_SLAVE.22 27.37,65.76 BT_SLAVE.21
  Top 0.305: H7.1 78.44,11.23 CON1.2 82.11,6.73 LED5.C | v31.6,56.82 32.06,56.82 LED2.C | IC1.57 35.97,36.42 | v31.6,56.82 32.46,55.96 H3.1 | J2.5 76.68,16.38 v79.48,16.38 | v79.43,31.57 79.43,34.25 77.87,35.8 76.87,35.8 J1.3 J1.5 J1.7 J1.9 | BT_SLAVE.21 29.11,64.02 29.26,64.02 30.71,62.57 30.71,57.83 31.6,56.94 v31.6,56.82 | BT_SLAVE.13 27.05,52.97 v27.05,46.97 23.02,46.97 22.95,46.89 22.36,46.89 21.4,47.85 21.4,48.41 C14.2 20.78,49.04 C13.2 | v38.38,48.87 37.41,48.87 v36.82,48.28
  Bottom 0.152: C10.2 34.35,36.51 | 34.35,36.51 33.18,35.34 C9.2 | 34.35,36.51 32.9,36.51 31.41,35.02 30.12,35.02 29.75,35.4 29.75,36.12 30.15,36.52 v30.15,38.73 | v33.4,31.37 33.55,31.52 33.55,32.16 34.38,32.99 C1.2 34.76,33.69 C2.2 | C6.2 37.81,36.49 C5.2
  Bottom 0.203: C21.2 | 35.58,46.69 C15.2 | C18.2 40.51,44.64 C19.2 | v38.91,30.56 38.91,28.12 v41.05,25.98 v41.05,25.97 39.45,24.37 C3.2 | C20.2 24.95,36.39 v23.75,37.59
  Bottom 0.305: C17.2 32.26,46.49 | 32.26,46.49 27.52,46.49 v27.05,46.97 | v79.48,16.38 79.43,16.43 v79.43,31.57 75.12,31.57 C21.2 | C21.2 C22.2 | C18.2 39.24,48.01 v38.38,48.87 | 35.58,46.69 36.82,47.93 v36.82,48.28 36.24,48.86 36.24,49.16 34.67,50.73 C16.2 32.66,49.84 32.26,49.44 32.26,46.49 | J2.5 75.01,10.16 CON1.2 78.47,6.69 C26.2 77.58,2.53 77.37,2.32 75.77,2.32 74.72,3.38 C27.2
  pour Bottom: 8.51,69.72 8.51,0.13 87.76,0.13 87.76,69.72
IND1
  Top 0.203: R1.1 29.64,67.12 13.25,67.12 12.66,66.54 12.66,66.46 BT_SLAVE.32
IND2
  Top 0.203: BT_SLAVE.31 14.16,66.46 14.16,66.54 14.34,66.72 27.99,66.72 31.71,63 R2.1
MID1
  Top 0.203: R1.2 37.96,58.37 LED1.A
MID2
  Top 0.203: LED2.A 33.61,60.47 R2.2
N$1  (via drill 0.35)
  Top 0.203: LED3.C 30.3,24.88 v30.3,24.69
  Bottom 0.203: R10.1 29.6,23.99 v30.3,24.69
N$2  (via drill 0.35)
  Top 0.203: v26.42,27 26.42,26.5 LED4.C
  Bottom 0.203: R11.1 27.43,28.02 v26.42,27
P0.0
  Top 0.152: IC1.19 38.92,32.05
  Top 0.203: 38.92,32.05 42.87,32.05 43.05,31.88 43.05,25.96 37.57,20.47 RN2.4
P0.0_O
  Top 0.203: RN2.13 32.46,14.59 32.27,14.4 32.27,9.69 J3.21
P0.1
  Top 0.152: IC1.20 39.05,32.49
  Top 0.203: 39.05,32.49 43.02,32.49 43.56,31.94 43.56,24.46 38.68,19.58 RN2.3
P0.1_O
  Top 0.203: RN2.14 33.36,13.69 33.17,13.5 33.17,10.39 34.4,9.15 34.4,7.28 J3.22
P0.2
  Top 0.152: IC1.21 39.21,32.89
  Top 0.203: 39.21,32.89 43.21,32.89 44.12,31.98 44.12,23.51 41.19,20.58 41.1,20.48 39.29,18.68 RN2.2
P0.2_O
  Top 0.203: RN2.15 34.26,12.79 34.07,12.6 34.07,12.35 35.81,10.61 J3.19
P0.3
  Top 0.152: IC1.22 39.37,33.3
  Top 0.203: 39.37,33.3 43.66,33.3 44.78,32.18 44.78,22.61 40.17,18 RN2.1
P0.3_O
  Top 0.203: J3.20 35.81,7.09 36.94,8.22 36.94,10.97 RN2.16
P0.4
  Top 0.152: IC1.24 39.64,34.16
  Top 0.203: 39.64,34.16 44.31,34.16 45.3,35.15 50.1,35.15 51.13,34.12 51.13,24.38 RN3.7
P0.4_O  (via drill 0.35)
  Top 0.203: RN3.10 44.17,16.66 v42.65,15.14
  Bottom 0.203: v42.65,15.14 38.35,10.85 J3.17
P0.5
  Top 0.152: IC1.25 39.8,34.57
  Top 0.203: 39.8,34.57 43.71,34.57 45.19,36.04 50.67,36.04 52.04,34.67 52.04,23.5 RN3.6
P0.5_O
  Top 0.203: RN3.11 45.07,15.65 42.02,12.61 42.02,8.22 41.36,7.56 39.76,7.56 J3.18
P0.6  (via drill 0.35)
  Top 0.152: IC1.26 39.96,34.98
  Top 0.203: J2.1 72.26,27.61 J1.2 72.26,34.52 v71.3,33.55 | 39.96,34.98 42.8,34.98 v44.27,36.45
  Bottom 0.203: v44.27,36.45 65.56,36.45 68.66,33.35 71.09,33.35 v71.3,33.55
P0.7  (via drill 0.35)
  Top 0.152: IC1.27 40.1,35.4
  Top 0.203: J2.2 70.41,26.92 70.41,35.52 71.25,36.36 72.25,36.36 J1.4 71.66,36.94 70.74,36.94 70.26,37.42 v70.26,38.08 | 40.1,35.4 41.91,35.4 43.41,36.91 v43.41,36.96
  Bottom 0.203: v43.41,36.96 44.53,38.08 v70.26,38.08
P1.0  (via drill 0.35)
  Top 0.152: 40.69,37.01 IC1.28
  Top 0.203: 40.69,37.01 v41.68,37.01 | v29.39,29.54 29.41,29.52 LED3.A | v47.35,27.63 48.29,26.69 RN3.8
  Bottom 0.203: v47.35,27.63 47.29,27.63 46.2,26.54 46.2,26.43 | v29.39,29.54 35.61,23.32 45.57,23.32 46.2,23.95 46.2,26.43 | v41.68,37.01 41.68,36.64 41.72,36.61 41.72,31.78 41.57,31.63 41.57,31.06 46.2,26.43
P1.0_O
  Top 0.203: RN3.9 43.27,17.44 41.62,15.79 41.62,9.41 J3.15
P1.1  (via drill 0.35)
  Top 0.152: IC1.29 40.07,37.67 51.33,37.67
  Top 0.203: 51.33,37.67 53.19,35.81 53.19,22.83 v52.71,22.35 50.99,20.64 RN3.5 | LED4.A 29.12,23.77 v30.33,22.55
  Bottom 0.203: v52.71,22.35 48.46,18.11 40.62,18.11 36.17,22.55 v30.33,22.55
P1.1_O
  Top 0.203: RN3.12 45.96,14.75 44.84,13.63 44.84,5.47 44.04,4.67 42.37,4.67 J3.16
P1.2
  Top 0.152: IC1.30 39.97,38.12
  Top 0.203: 39.97,38.12 51.45,38.12 54.48,35.09 54.48,22.34 RN3.4
P1.2_O
  Top 0.203: RN3.13 46.86,13.85 46.67,13.66 46.67,9.39 J3.11
P1.3
  Top 0.152: IC1.31 39.81,38.53
  Top 0.203: 39.81,38.53 51.64,38.53 55.4,34.77 55.4,21.46 RN3.3
P1.3_O
  Top 0.203: RN3.14 47.76,12.95 47.38,12.58 47.38,7.56 J3.12
P1.4  (via drill 0.35)
  Top 0.152: IC1.32 39.8,39.09
  Top 0.203: 39.8,39.09 42.04,39.09 42.9,39.95 v42.9,40.05 | v16.33,48.28 13.62,48.28 11.85,50.06 R5.1 11.8,50.32 10.75,51.37 10.32,51.37 8.97,52.73 BT_SLAVE.1 | v33.27,53.72 32.44,52.88 H1.1
  Bottom 0.203: 34.47,51.69 36.18,51.69 37.48,50.39 37.48,42.67 39.38,40.77 42.18,40.77 v42.9,40.05 | 34.47,51.69 32.55,51.69 29.13,48.27 16.34,48.27 v16.33,48.28 | 34.47,51.69 33.27,52.88 v33.27,53.72
P1.5  (via drill 0.35)
  Top 0.152: IC1.33 40.2,40.06
  Top 0.203: 40.2,40.06 v40.92,40.06 | H2.1 29.19,51.36 v29.19,51.41 | v14.4,48.95 14.4,50.13 R4.1 13.68,50.32 12.62,51.37 12.07,51.37 10.47,52.98 BT_SLAVE.2
  Bottom 0.203: v40.92,40.06 23.29,40.06 v14.4,48.95 16.28,50.83 28.6,50.83 v29.19,51.41
P1.6  (via drill 0.35)
  Top 0.152: IC1.34 40.35,40.77 45.64,40.77
  Top 0.203: v46.41,40.06 46.35,40.06 45.64,40.77 52.1,40.77 56.26,36.6 56.26,21.11 53.67,18.53 RN3.2 | v34.42,65.71 32.6,67.53 10.65,67.53 9.66,66.54 9.66,66.46 BT_SLAVE.34
  Bottom 0.203: v46.41,40.06 47.06,40.71 79.87,40.71 81.13,39.45 81.68,39.45 82.06,39.83 82.06,40.38 75.78,46.66 53.47,46.66 v34.42,65.71
P1.6_O
  Top 0.203: RN3.15 48.66,12.05 48.47,11.87 48.47,11.62 48.51,11.57 J3.9
P1.7
  Top 0.152: 40.24,41.22 IC1.35
  Top 0.203: 40.24,41.22 52.3,41.22 57.2,36.32 57.2,20.33 54.57,17.7 RN3.1
P1.7_O
  Top 0.203: RN3.16 49.55,9.24 49.64,9.15 49.64,7.28 J3.10
P2.0
  Top 0.152: IC1.37 38.68,40.8
  Top 0.203: 38.68,40.8 38.68,42.14 39.19,42.65 54.23,42.65 61.82,35.05 61.82,23.84 RN4.8
P2.0_O
  Top 0.203: RN4.9 56.58,17.72 51.06,12.2 J3.7
P2.1
  Top 0.152: IC1.38 38.28,40.96
  Top 0.203: 38.28,40.96 38.28,42.34 39.39,43.46 54.63,43.46 62.68,35.41 62.68,23.77 62.49,23.58 RN4.7
P2.1_O
  Top 0.203: J3.8 51.05,7.09 52.18,8.22 52.18,12.4 RN4.10
P2.2
  Top 0.152: IC1.39 37.87,41.12
  Top 0.203: 37.87,41.12 37.87,42.76 39.23,44.12 54.89,44.12 63.58,35.43 63.58,22.87 63.39,22.68 RN4.6
P2.2_O
  Top 0.203: RN4.11 53.59,12.02 J3.5
P2.3
  Top 0.152: IC1.40 37.41,41.23
  Top 0.203: 37.41,41.23 37.41,42.95 39.12,44.65 39.24,44.78 39.42,44.78 55.9,44.78 64.48,36.21 64.48,21.97 64.29,21.79 RN4.5
P2.3_O
  Top 0.203: J3.6 53.59,7.09 54.72,8.22 54.72,11.35 RN4.12
P2.4
  Top 0.152: IC1.41 36.91,41.29
  Top 0.203: 36.91,41.29 36.91,43.1 39.55,45.74 56.21,45.74 65.37,36.58 65.37,21.07 65.19,20.89 RN4.4
P2.4_O
  Top 0.203: RN4.13 56.13,10.96 J3.3
P2.5
  Top 0.152: IC1.42 36.37,41.32 36.37,43.44
  Top 0.203: 36.37,43.44 39.24,46.3 56.67,46.3 66.27,36.7 66.27,20.18 66.09,19.99 RN4.3
P2.5_O
  Top 0.203: RN4.14 57.26,10.3 57.26,8.22 56.13,7.09 J3.4
P2.6
  Top 0.152: IC1.43 34.62,41.45
  Top 0.203: 34.62,41.45 34.62,43.51 38.07,46.97 57.73,46.97 67.17,37.53 67.17,19.28 66.98,19.09 RN4.2
P2.6_O
  Top 0.203: RN4.15 58.67,9.91 J3.1
P2.7
  Top 0.152: IC1.44 34.16,41.34
  Top 0.203: 34.16,41.34 34.16,44.22 37.64,47.7 58.42,47.7 68.07,38.05 68.07,18.38 67.88,18.19 RN4.1
P2.7_O
  Top 0.203: RN4.16 59.8,9.24 59.8,7.74 58.67,6.61 J3.2
P3.0
  Top 0.152: IC1.47 27.51,46.3
  Top 0.203: 27.51,46.3 12.14,46.3 8.31,42.47 8.31,19.2 9.93,17.58 RN1.8
P3.0_O
  Top 0.203: J3.34 18.03,7.09 16.9,8.22 16.9,10.85 RN1.9
P3.1
  Top 0.152: IC1.48 27.54,45.69
  Top 0.203: 27.54,45.69 13.13,45.69 9.07,41.63 9.07,20.4 10.99,18.48 RN1.7
P3.1_O
  Top 0.203: RN1.10 18.03,11.51 J3.33
P3.2
  Top 0.152: IC1.49 27.74,44.93
  Top 0.203: 27.74,44.93 13.77,44.93 9.78,40.94 9.78,21.54 11.95,19.37 RN1.6
P3.2_O
  Top 0.203: J3.32 20.57,7.09 19.44,8.22 19.44,11.9 RN1.11
P3.3
  Top 0.152: IC1.50 28.29,43.81
  Top 0.203: 28.29,43.81 14.02,43.81 10.29,40.08 10.29,22.83 12.85,20.27 RN1.5
P3.3_O
  Top 0.203: RN1.12 20.57,12.56 J3.31
P3.4
  Top 0.152: IC1.51 28.44,43.1
  Top 0.203: 28.44,43.1 14.45,43.1 10.87,39.52 10.87,24.01 13.71,21.17 RN1.4
P3.4_O
  Top 0.203: J3.30 23.11,7.09 21.98,8.22 21.98,12.95 RN1.13
P3.5
  Top 0.152: IC1.52 28.38,42.6
  Top 0.203: 28.38,42.6 15.75,42.6 11.53,38.38 11.53,24.99 14.46,22.07 RN1.3
P3.5_O
  Top 0.203: RN1.14 23.11,13.62 J3.29
P3.6
  Top 0.152: IC1.53 28.32,42.09
  Top 0.203: 28.32,42.09 16.99,42.09 13.79,38.89 13.79,24.73 RN1.2
P3.6_O
  Top 0.203: J3.28 25.65,7.09 24.52,8.22 24.52,14 RN1.15
P3.7
  Top 0.152: IC1.54 28.29,41.55
  Top 0.203: 28.29,41.55 17.98,41.55 15.32,38.89 15.32,25.01 RN1.1
P3.7_O
  Top 0.203: RN1.16 25.65,14.67 J3.27
P4.0
  Top 0.152: IC1.5 31.24,33.93
  Top 0.203: RN2.8 31.24,26.71 31.24,33.93
P4.0_O
  Top 0.203: RN2.9 28.87,18.18 27.06,16.38 27.06,8.22 28.19,7.09 J3.26
P4.1
  Top 0.152: IC1.6 31.65,33.77
  Top 0.203: RN2.7 35.46,23.84 35.46,26.19 31.65,30 31.65,33.77
P4.1_O
  Top 0.203: RN2.10 29.77,17.28 28.51,16.03 28.51,9 J3.25
P5.0
  Top 0.152: IC1.7 32.05,33.61
  Top 0.203: RN2.6 35.7,22.27 36.5,23.07 36.5,25.94 32.05,30.39 32.05,33.61
P5.0_O
  Top 0.203: RN2.11 30.66,16.38 29.6,15.32 29.6,7.28 J3.24
P5.1
  Top 0.152: IC1.8 32.46,33.45
  Top 0.203: RN2.5 37.8,22.59 37.8,25.25 32.46,30.58 32.46,33.45
P5.1_O
  Top 0.203: RN2.12 31.56,15.48 31.37,15.3 31.37,9.33 J3.23
P6.0
  Top 0.152: IC1.2 29.32,33.7
  Top 0.203: 29.32,33.7 Y1.1 27.59,33.69 C24.2
P6.1
  Top 0.152: IC1.3 29.36,33.17
  Top 0.203: 29.36,33.17 Y1.2 29.36,31.77 C23.2
VCCD  (via drill 0.35)
  Top 0.152: IC1.56 30.48,37.47
  Top 0.203: 30.48,37.47 29.49,38.46 v27.89,38.46
  Bottom 0.203: v27.89,38.46 27.86,38.43 26.53,38.43 C20.1
VDDA  (via drill 0.35)
  Top 0.152: IC1.46 32.74,41.63 | IC1.36 39.52,41.08
  Top 0.203: 32.74,41.63 v32.74,42.67 | v39.52,41.55 39.52,41.08
  Top 0.305: H5.1 65.29,4.39 L3.2 63.92,6.32 62.71,7.53 62.71,8.58 67.65,13.53 76,13.53 77.38,14.91 79.68,14.91 81.41,16.64 v81.41,40.11 | v35.53,48.87 35.53,48.91 36.46,49.83 v43.51,49.83
  Bottom 0.203: v32.74,42.67 32.31,43.1 C17.1 33.55,45.84 C16.1 | v39.52,41.55 39.29,41.78 39.29,42.69 C18.1 40.31,43.8 C19.1
  Bottom 0.305: v81.41,40.11 79.22,42.29 43.1,42.29 41.69,43.7 | 41.69,43.7 C19.1 | C16.1 35.5,48.83 v35.53,48.87 | v43.51,49.83 43.51,45.52 41.69,43.7
VDDD  (via drill 0.35)
  Top 0.152: IC1.23 39.5,33.74 | IC1.1 30.84,35.78 v30.38,35.78
  Top 0.203: 39.5,33.74 45.77,33.74 C11.1 49.17,34.2 C12.1
  Top 0.305: v10.9,13.46 10.9,10.27 18.63,2.53 59.83,2.53 v59.97,2.67 59.99,2.64 H4.1 | v19.84,27.33 19.93,27.42 R3.2 | C12.1 50.12,33.25 50.33,33.05 50.33,31.45 49.61,30.73 v49.61,26.59 | L4.2 66.6,2.5 64.33,2.5 61.42,5.41 61.42,8.16 70.5,17.25 J2.4 78.26,20.5 v78.26,29.34 78.26,33.15 J1.1 | 61.82,2.78 H4.1 | R4.2 16.73,50.94 C13.1 | C13.1 20.78,50.94 C14.1 21.11,50.91 | BT_SLAVE.12 24.82,52.42 24.82,52.26 23.47,50.91 21.11,50.91 | C13.1 17.95,50.32 17.04,49.41 17.04,47.99 16.63,47.58 12.68,47.58 10.84,49.42 R5.2 | v30.38,35.78 28.42,37.75 27.6,37.75 24.63,40.71 v24.05,40.71 | v22.66,47.6 21.91,48.35 21.91,49.81 21.11,50.61 21.11,50.91 | H4.1 66.74,2.64 L4.2 | LED5.A 79.52,2.04 68.3,2.04 68.09,2.25 L4.2
  Bottom 0.152: v30.38,35.78 31.29,36.69 C9.1 32.83,38.01 C10.1
  Bottom 0.305: v10.9,13.46 10.9,22.76 15.47,27.33 v19.84,27.33 | v59.97,2.67 59.9,2.73 59.9,16.36 49.68,26.59 v49.61,26.59 | v78.26,29.34 74.92,29.34 C21.1 C22.1 | v24.05,40.71 22.66,42.11 v22.66,47.6
  pour Top: 8.61,69.22 8.61,0.63 87.25,0.63 87.25,68.71 86.74,69.22
VDDR  (via drill 0.35)
  Top 0.152: IC1.15 37.34,31.38 | IC1.14 34.75,32.34 34.75,30.43 | IC1.18 38.79,31.62 | IC1.10 33.43,33.28
  Top 0.203: 37.34,31.38 v37.34,29.84 | v34.16,29.84 34.75,30.43 | v34.19,31.9 33.93,31.9 33.43,32.41 33.43,33.28 | v42.23,31.36 41.97,31.62 38.79,31.62
  Top 0.305: H6.1 65.5,8.18 67.52,10.2 L2.2 68.45,11.13 68.66,11.34 69.28,11.34 v70.41,12.47
  Bottom 0.152: v34.19,31.9 34.63,32.35 C1.1 36.1,32.35 C2.1 38.77,35.02 C6.1 39.15,35.14 C5.1
  Bottom 0.203: C3.1 36.6,28.43 C4.1 37.34,29.25 v37.34,29.84 v34.16,29.84 | C8.1 44.91,31.87 C7.1 42.74,31.87 v42.23,31.36
  Bottom 0.305: v70.41,12.47 70.41,26.01 65.36,31.05 C8.1 | C7.1 42.39,33.01 42.39,37.55 41.98,37.97 41.13,37.97 38.15,34.99 38.15,30.66 v37.34,29.84 35.28,31.9 v34.19,31.9
VREF  (via drill 0.35)
  Top 0.152: IC1.45 33.48,41.46
  Top 0.203: 33.48,41.46 v33.48,43.23
  Bottom 0.203: v33.48,43.23 35.02,44.77 C15.1
XTAL24I
  Top 0.152: IC1.16 38.25,31.03 38.25,29.55
  Top 0.203: Y2.1 39.93,27.87 38.25,29.55
XTAL24O
  Top 0.152: IC1.17 38.63,31.22 39.91,31.22
  Top 0.203: 39.91,31.22 Y2.3

### Text on the board
tPlace: + | - | - | + | BT_GND | BT_TX | Purdue University / ECE477 Team21 RoboTar / MCU Board V2.0 / Zhewen Pan | BT_RX | MINIPROG3 | GND | XRES | GND | GND | P0.7 | GND | P0.6 | VDDD | RESET | + | SWD | - | - | P0.6 | + | P0.7 | XRES | VDDD | GND | GND | GND | 3V3 | P3.1 | P3.3 | P3.5 | P3.7 | P4.1 | P5.1 | P0.0 | P0.2 | P0.4 | P1.0 | P1.2 | P1.6 | P2.0 | P2.2 | P2.4 | P2.6 | VDDR | Power | - | VDDA | + | P3.0 | P3.2 | P3.4 | P3.6 | P4.0 | P5.0 | P0.1 | P0.3 | P0.5 | P1.1 | P1.3 | P1.7 | P2.1 | P2.3 | P2.5 | P2.7 | P2.7 | VDDD